# EasyEDA schematic appledore_11a.json
TITLE: APPLEDORE - C64/C16 keyboard adapter; REV: 1.1a; Date: 2022-12-21; Sheet: 1/1; Drawn By: CP; Company: P-LAB
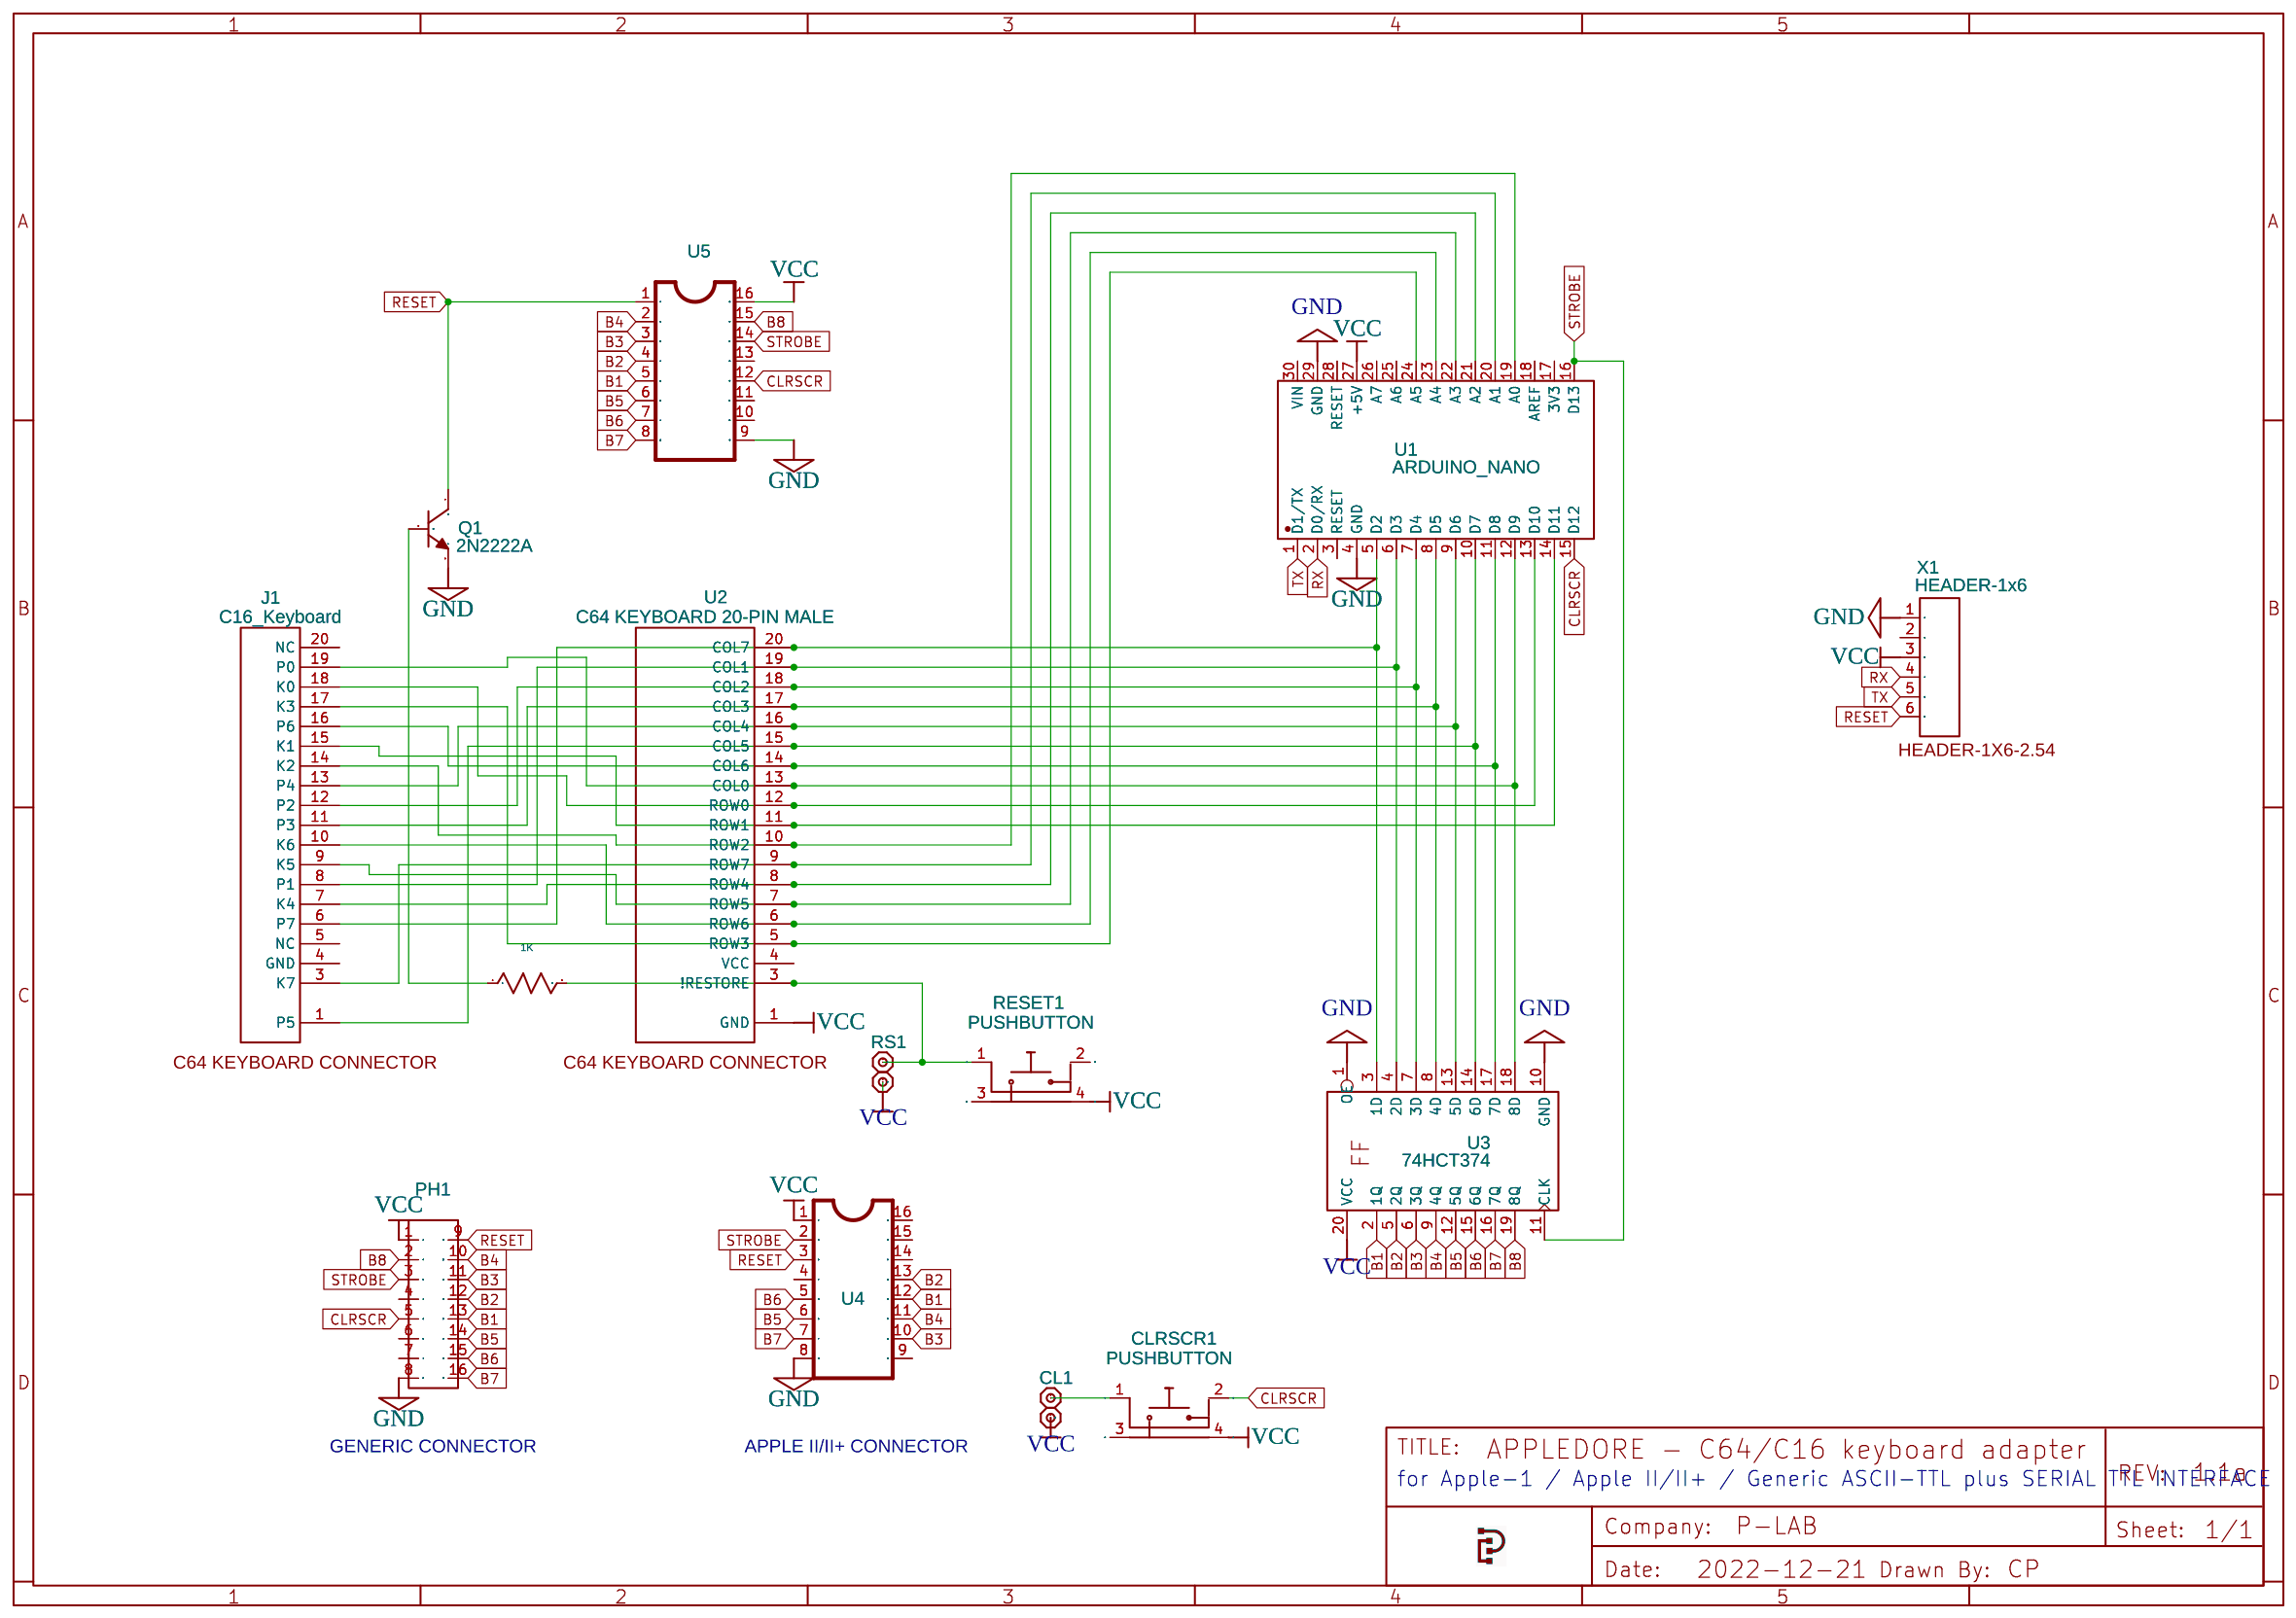
[diagram p0: schematic sheet]

## Parts
1K  1/4W RESISTOR  [AXIAL-6.5X2.3(1/4W)]
CL1  Header_Pass_Through_1x2  [HEADER_MALE_1X2]
CLRSCR1  PUSHBUTTON  [TACTILE-PTH]
J1  C16_Keyboard  [C64 KEYBOARD CONNECTOR]
PH1  pinheader08x2  [PINHEADER_08X2]
Q1  2N2222A  [TO-92-3_L4.8-W3.7-P2.54-R]
RESET1  PUSHBUTTON  [TACTILE-PTH]
RS1  Header_Pass_Through_1x2  [HEADER_MALE_1X2]
U1  ARDUINO_NANO  [COMM-TH_ARDUINO_NANO]
U2  C64 KEYBOARD 20-PIN MALE  [C64 KEYBOARD CONNECTOR]
U3  74HCT374  [DIP20]
U4  IC_DIL16-DIP16  [DIP16]
U5  IC_DIL16-DIP16  [DIP16]
X1  HEADER-1x6  [HEADER-1X6-2.54]

## Library data of the parts
1K = 1/4W RESISTOR: Contributor: NashvilleAmps
CL1 RS1 = Header_Pass_Through_1x2: Manufacturer Part: New SchematicLib; Contributor: breezebro; Package Display: No
CLRSCR1 RESET1 = PUSHBUTTON: sourceId: W2ysK2Wdv
J1 = C16_Keyboard: Contributor: zeus074_5150; Package Display: Yes
PH1 = pinheader08x2: Manufacturer Part: Header 6x1; Contributor: s1atbewie.de
Q1 = 2N2222A: Supplier: LCSC; Supplier Part: C358533; Manufacturer: BLUE ROCKET(蓝箭); Contributor: LCSC; JLCPCB Part Class: Extended Part; Package Display: No
U1 = ARDUINO_NANO: Supplier: LCSC; Supplier Part: C9900017879; Manufacturer: null; JLCPCB Part Class: Extended Part; Contributor: lcsc; Package Display: No
U2 = C64 KEYBOARD 20-PIN MALE: Contributor: TomPilot; Package Display: Yes
U3 = 74HCT374: Package Display: No
U4 U5 = IC_DIL16-DIP16: Universal 16 pins IC; Contributor: DangerousPrototype
X1 = HEADER-1x6: Supplier Part: undefined; Supplier: Mouser; Contributor: Ryan White; Package Display: Yes

## Nets
GND: PH1.8 Q1.3(E) U1.4(GND) U1.29(GND) U3.1(OE) U3.10(GND) U4.8 U5.9 X1.1
VCC: CL1.2 CLRSCR1.4 PH1.1 RESET1.4 RS1.2 U1.27(+5V) U2.1(GND) U3.20(VCC) U4.1 U5.16 X1.3
B1: PH1.13 U3.2(1Q) U4.12 U5.5
B2: PH1.12 U3.5(2Q) U4.13 U5.4
B3: PH1.11 U3.6(3Q) U4.10 U5.3
B4: PH1.10 U3.9(4Q) U4.11 U5.2
B5: PH1.14 U3.12(5Q) U4.6 U5.6
B6: PH1.15 U3.15(6Q) U4.5 U5.7
B7: PH1.16 U3.16(7Q) U4.7 U5.8
B8: PH1.2 U3.19(8Q) U5.15
CLRSCR: CLRSCR1.2 PH1.5 U1.15(D12) U5.12
RESET: PH1.9 Q1.1(C) U4.3 U5.1 X1.6
RX: U1.2(D0/RX) X1.4
STROBE: PH1.3 U1.16(D13) U3.11(CLK) U4.2 U5.14
TX: U1.1(D1/TX) X1.5
Net-(1K-1): 1K.1 Q1.2(B)
Net-(1K-2): 1K.2 RESET1.1 RS1.1 U2.3(!RESTORE)
Net-(CL1-1): CL1.1 CLRSCR1.1
Net-(J1-1): J1.1(P5) U1.10(D7) U2.15(COL5) U3.14(6D)
Net-(J1-3): J1.3(K7) U1.20(A1) U2.9(ROW7)
Net-(J1-6): J1.6(P7) U1.5(D2) U2.20(COL7) U3.3(1D)
Net-(J1-7): J1.7(K4) U1.21(A2) U2.8(ROW4)
Net-(J1-8): J1.8(P1) U1.6(D3) U2.19(COL1) U3.4(2D)
Net-(J1-9): J1.9(K5) U1.22(A3) U2.7(ROW5)
Net-(J1-10): J1.10(K6) U1.23(A4) U2.6(ROW6)
Net-(J1-11): J1.11(P3) U1.8(D5) U2.17(COL3) U3.8(4D)
Net-(J1-12): J1.12(P2) U1.7(D4) U2.18(COL2) U3.7(3D)
Net-(J1-13): J1.13(P4) U1.9(D6) U2.16(COL4) U3.13(5D)
Net-(J1-14): J1.14(K2) U1.19(A0) U2.10(ROW2)
Net-(J1-15): J1.15(K1) U1.14(D11) U2.11(ROW1)
Net-(J1-16): J1.16(P6) U1.11(D8) U2.14(COL6) U3.17(7D)
Net-(J1-17): J1.17(K3) U1.24(A5) U2.5(ROW3)
Net-(J1-18): J1.18(K0) U1.13(D10) U2.12(ROW0)
Net-(J1-19): J1.19(P0) U1.12(D9) U2.13(COL0) U3.18(8D)

Not connected (* = marked no-connect by the designer): CLRSCR1 3; J1 4(GND) 5(NC) 20(NC); PH1 4 6 7; RESET1 2 3; U1 3(RESET) 17(3V3) 18(AREF) 25(A6) 26(A7) 28(RESET) 30(VIN); U2 4(VCC); U4 4 9 14 15 16; U5 10 11 13; X1 2

## Notes on the sheet
- GENERIC CONNECTOR
- APPLE II/II+ CONNECTOR
- for Apple-1 / Apple II/II+ / Generic ASCII-TTL plus SERIAL TTL INTERFACE
